# Altium schematic sheet Sheet1.SchDoc: PhotoCell
size A4; CompanyName: aKaReZa; Revision: 1.0; SheetNumber: 1; SheetTotal: 1; Project_Name: PerfBoard
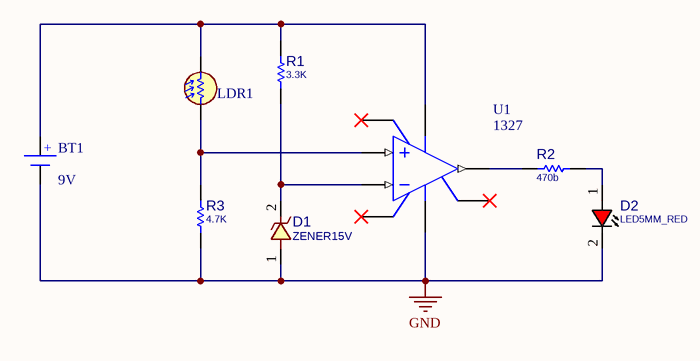
[diagram p0: Sheet1.SchDoc]

## Parts
BT1  9V  [XH02_Batt]
D1  ZENER15V  [D_AX04_DO41]
D2  LED5MM_RED  [LED5MM_RED]
LDR1  PhotoCell  [PhotoCell]  (value not drawn)
R1  3.3K  [R025W_AX04]
R2  470b  [R025W_AX04]
R3  4.7K  [R025W_AX04]
U1  Inflow: 1327  [CDIP8]  (hidden comment: LM741)

## Nets
GND: BT1.2(-) D1.1 D2.2(CATHODE) R3.1 U1.4(V-)
NetBT1_1: BT1.1(+) LDR1.2 R1.2 U1.7(V+)
NetD1_2: D1.2 R1.1 U1.2(IN-)
NetD2_1: D2.1(ANODE) R2.1
NetLDR1_1: LDR1.1 R3.2 U1.3(IN+)
NetR2_2: R2.2 U1.6(OUT)

Not connected (* = marked no-connect by the designer): U1 1(BAL)* 5(BAL)* 8(NC)*

## Notes on the sheet
- Title:
- Project:
- Drawn by:
- Revision:
- Hossein Bagheri
- Company:
- Sheet
- of

## Library data of the parts
BT1 = Other_Elec_Battery: Multicell Battery; Inflow: inflow?; Rating: Rating?; Validation: NT; Package: Package?; Type: Type?; Value: 9V
D1 = DIODE_THD_ZENER: DIODE, ZENER, 0.2W, 15V; MANF: Diodes; DESC: DESCRIPTION; ASSEMBLY: ASSEMBLY; PRICE: PRICE; PARAM2: 0.2W; PARAM: 15V; MANF_P#: ZENER15V; VALUE: ZENER15V
D2 = LED_THD_5MM_RED: LED, THD, 5MM, RED; DESC: DESCRIPTION; MANF_P#: MANF_PART#; PARAM2: 2.2V; MANF: MANF; ASSEMBLY: ASSEMBLY; PRICE: PRICE; VALUE: LED5MM_RED
LDR1 = LDR: Photo Cell- Variable Resistor With Light; Value: PhotoCell
R1-R3 = RES_THD: RESISTOR, THD; MANF_P#: RK73H1ETTP4701F; MANF: KOA SPEER; PARAM: 0.063W; DESC: DESCRIPTION; DIST#: MOUSER; PARAM2: 1%; ASSEMBLY: ASSEMBLY; PRICE: 100= 0.5$
  R1: VALUE: 3.3K
  R2: VALUE: 470b
  R3: VALUE: 4.7K
U1 = IC_Opamp_LF411CN: Low offset, low drift JFET input operational amplifie; Rating: Rating?; Validation: NT; Value: LM741; Package: Package?; Type: Type?